# Altium schematic sheet altium.schdoc
size 226 x 135 mm
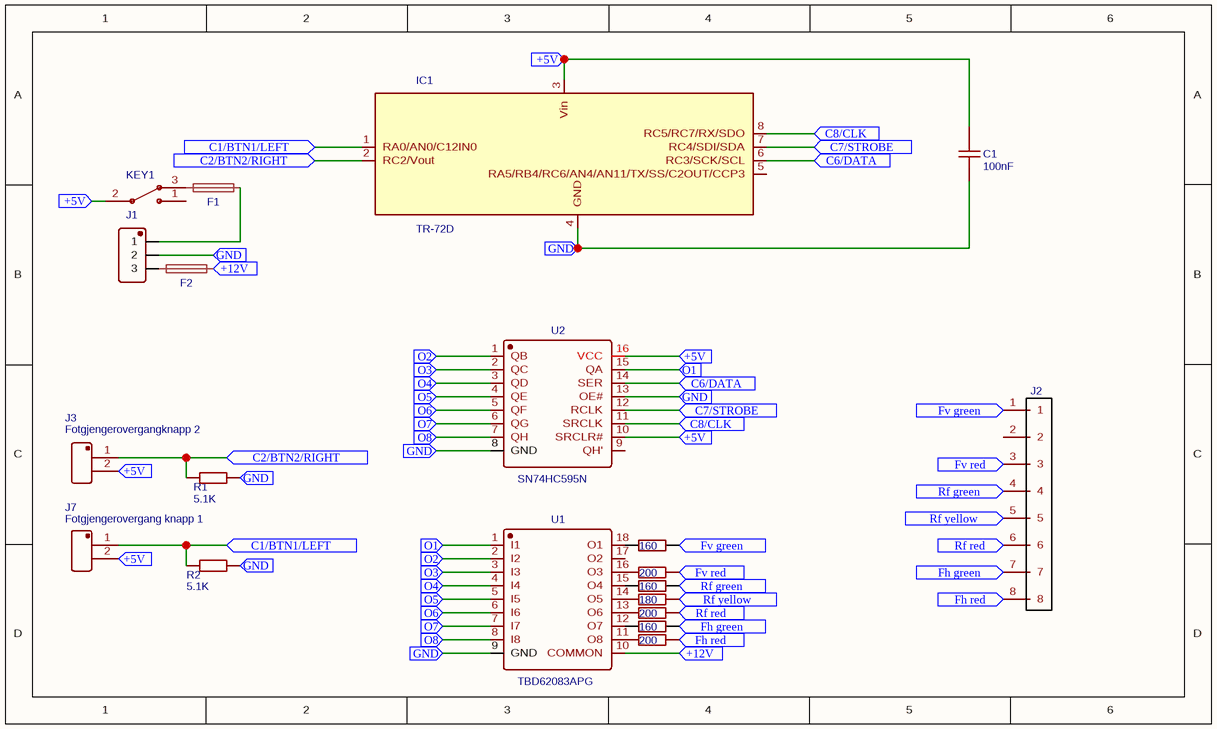
[diagram p0: altium.schdoc]

## Parts
C1  100nF  [1210]
F1  NO  [OMF_125]  (value not drawn)
F2  NO  [OMF_125]  (value not drawn)
IC1  TR-72D  [IQRF_KON-SIM-01]
J1  KF127_3P_5.08  [KF127_3P_5.08]  (value not drawn)
J2  KF127-8P  [KF127-8P]  (value not drawn)
J3  Fotgjengerovergangknapp 2  [KF127_2P_5.08]
J7  Fotgjengerovergang knapp 1  [KF127_2P_5.08]
KEY1  MSK-11027 Toggle Switches  [MSK-11027]  (value not drawn)
R1  5.1K  [1206]
R2  5.1K  [1206]
R8  160  [1206]
R9  160  [1206]
R10  160  [1206]
R12  180  [1206]
R13  200  [1206]
R14  200  [1206]
R15  200  [1206]
U1  TBD62083APG  [DIP-18]
U2  SN74HC595N  [DIP-16_L19.8-W6.5-P2.54-LS7.6-BL]

## Ports
+5V, +12V, C1/BTN1/LEFT, C2/BTN2/RIGHT, C6/DATA, C7/STROBE, C8/CLK, Fh green, Fh red, Fv green, Fv red, GND, O1, O2, O3, O4, O5, O6, O7, O8, Rf green, Rf red, Rf yellow

## Nets
+5V: C1.2 IC1.3(Vin) J3.2(PIN2) J7.2(PIN2) KEY1.2 U2.10(SRCLR#) U2.16(VCC) ; port +5V
+12V: F2.2 U1.10(COMMON) ; port +12V
C1/BTN1/LEFT: IC1.1(RA0/AN0/C12IN0) J7.1(PIN1) R2.1 ; port C1/BTN1/LEFT
C2/BTN2/RIGHT: IC1.2(RC2/Vout) J3.1(PIN1) R1.1 ; port C2/BTN2/RIGHT
C6/DATA: IC1.6(RC3/SCK/SCL) U2.14(SER) ; port C6/DATA
C7/STROBE: IC1.7(RC4/SDI/SDA) U2.12(RCLK) ; port C7/STROBE
C8/CLK: IC1.8(RC5/RC7/RX/SDO) U2.11(SRCLK) ; port C8/CLK
Fh green: J2.7 R10.2 ; port Fh green
Fh red: J2.8 R15.2 ; port Fh red
Fv green: J2.1 R8.2 ; port Fv green
Fv red: J2.3 R13.2 ; port Fv red
GND: C1.1 IC1.4(GND) J1.2 R1.2 R2.2 U1.9(GND) U2.8(GND) U2.13(OE#) ; port GND
O1: U1.1(I1) U2.15(QA) ; port O1
O2: U1.2(I2) U2.1(QB) ; port O2
O3: U1.3(I3) U2.2(QC) ; port O3
O4: U1.4(I4) U2.3(QD) ; port O4
O5: U1.5(I5) U2.4(QE) ; port O5
O6: U1.6(I6) U2.5(QF) ; port O6
O7: U1.7(I7) U2.6(QG) ; port O7
O8: U1.8(I8) U2.7(QH) ; port O8
Rf green: J2.4 R9.2 ; port Rf green
Rf red: J2.6 R14.2 ; port Rf red
Rf yellow: J2.5 R12.2 ; port Rf yellow
NetF1_1: F1.1 KEY1.3
NetF1_2: F1.2 J1.1
NetF2_1: F2.1 J1.3
NetR8_1: R8.1 U1.18(O1)
NetR9_1: R9.1 U1.15(O4)
NetR10_1: R10.1 U1.12(O7)
NetR12_1: R12.1 U1.14(O5)
NetR13_1: R13.1 U1.16(O3)
NetR14_1: R14.1 U1.13(O6)
NetR15_1: R15.1 U1.11(O8)

Not connected (* = marked no-connect by the designer): IC1 5(RA5/RB4/RC6/AN4/AN11/TX/SS/C2OUT/CCP3); J2 2; KEY1 1; U1 17(O2); U2 9(QH')

## Library data of the parts
C1 = 100nF: BOM_Manufacturer: Huaxin S&T; BOM_Manufacturer Part: 1210B106K100CT; nameAlias: Capacitance; Contributor: LCSC; BOM_Supplier: LCSC; BOM_Supplier Part: C304011; spicePre: C; spiceSymbolName: 1210B106K100CT
F1 F2 = NO: BOM_Manufacturer Part: 3403.0015.11; Contributor: romiksm; BOM_Supplier: Mouser; BOM_Supplier Part: 693-3403.0015.11; link: https://www.mouser.co.uk/ProductDetail/Schurter/3403001511?qs=sGAEpiMZZMtxU2g%2f1juGqdRmCQF0%252bT4VUkZkHB0fJk4%3d; spicePre: F
IC1 = TR-72D: Contributor: Simen Stensas; license: https://www.gnu.org/licenses/lgpl-2.1.html; spicePre: I
J1 = KF127_3P_5.08: BOM_Manufacturer: Kefa Electronics; Contributor: GrahamG; BOM_Manufacturer Part: KF127_3P_5.08; spicePre: J
J2 = KF127-8P: BOM_Manufacturer: CIXI KAIFEN ELECTRONICS CO,. LTDA.; Contributor: milton.sanchez.alban; spicePre: U
J3 = Fotgjengerovergangknapp 2: BOM_Manufacturer: Kefa Electronics; BOM_Manufacturer Part: KF127L-5.08; Contributor: GrahamG; spicePre: J
J7 = Fotgjengerovergang knapp 1: BOM_Manufacturer: Kefa Electronics; BOM_Manufacturer Part: KF127L-5.08; Contributor: GrahamG; spicePre: J
KEY1 = MSK-11027 Toggle Switches: BOM_Manufacturer: ReliaPro; BOM_Supplier Part: C21381; BOM_Supplier: LCSC; BOM_Manufacturer Part: MSK-11027 Toggle Switches; image: http://image.lceda.cn/szlcsc/C21381.jpg; spicePre: K
R1 R2 = 5.1K: BOM_Manufacturer: Tyohm; BOM_Manufacturer Part: RMC12065.1K1%N; nameAlias: Resistance (Ohms); Contributor: LCSC; BOM_Supplier: LCSC; BOM_Supplier Part: C325932; spicePre: R; spiceSymbolName: RMC12065.1K1%N
R8-R10 = 160: BOM_Manufacturer: YAGEO; BOM_Manufacturer Part: RC1206JR-07160RL; nameAlias: Resistance (Ohms); BOM_Supplier: LCSC; BOM_Supplier Part: C137196; spicePre: R; spiceSymbolName: RC1206JR-07160RL
R12 = 180: BOM_Manufacturer: BOURNS; BOM_Manufacturer Part: CR1206-FX-1800ELF; nameAlias: Resistance (Ohms); Contributor: LCSC; BOM_Supplier: LCSC; BOM_Supplier Part: C204708; spicePre: R; spiceSymbolName: CR1206-FX-1800ELF
R13-R15 = 200: BOM_Manufacturer: EVER OHMS; BOM_Manufacturer Part: QR1206J200RP05; nameAlias: Resistance (Ohms); Contributor: LCSC; BOM_Supplier: LCSC; BOM_Supplier Part: C149886; spicePre: R; spiceSymbolName: QR1206J200RP05
U1 = TBD62083APG: BOM_Manufacturer: TOSHIBA; Contributor: LCSC; BOM_Supplier: LCSC; BOM_Manufacturer Part: TBD62083APG; BOM_Supplier Part: C114143; spicePre: U
U2 = SN74HC595N: BOM_Manufacturer: TI; BOM_Supplier: LCSC; BOM_Manufacturer Part: SN74HC595N; image: //image.lceda.cn/szlcsc/C78711.jpg; BOM_Supplier Part: C78711; spicePre: U